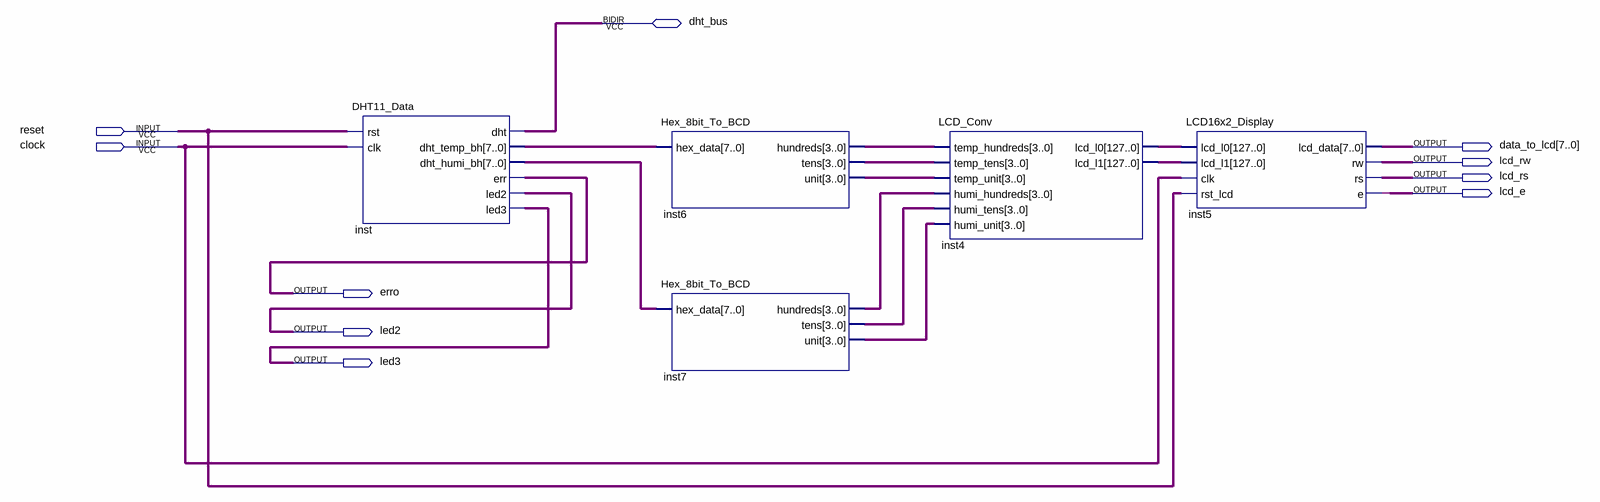
[diagram p0: schematic sheet]
// Quartus schematic Top_Entity.bdf as structural Verilog: 5 symbols, 10 pins
module Top_Entity (
  input  reset,
  input  clock,
  inout  dht_bus,
  output [7:0] data_to_lcd,
  output lcd_rw,
  output lcd_rs,
  output lcd_e,
  output erro,
  output led2,
  output led3
);

  wire [3:0] inst6_hundreds, inst6_tens, inst6_unit, inst7_hundreds, inst7_tens, inst7_unit;
  wire [7:0] inst_dht_humi_bh, inst_dht_temp_bh;
  wire [127:0] inst4_lcd_l0, inst4_lcd_l1;

  DHT11_Data inst (
    .rst(reset), .clk(clock), .dht_temp_bh(inst_dht_temp_bh), .dht_humi_bh(inst_dht_humi_bh), .err(erro),
    .led2(led2), .led3(led3), .dht(dht_bus));
  Hex_8bit_To_BCD inst6 (.hex_data(inst_dht_temp_bh), .hundreds(inst6_hundreds), .tens(inst6_tens), .unit(inst6_unit));
  Hex_8bit_To_BCD inst7 (.hex_data(inst_dht_humi_bh), .hundreds(inst7_hundreds), .tens(inst7_tens), .unit(inst7_unit));
  LCD_Conv inst4 (
    .temp_hundreds(inst6_hundreds), .temp_tens(inst6_tens), .temp_unit(inst6_unit),
    .humi_hundreds(inst7_hundreds), .humi_tens(inst7_tens), .humi_unit(inst7_unit), .lcd_l0(inst4_lcd_l0),
    .lcd_l1(inst4_lcd_l1));
  LCD16x2_Display inst5 (
    .lcd_l0(inst4_lcd_l0), .lcd_l1(inst4_lcd_l1), .clk(clock), .rst_lcd(reset), .lcd_data(data_to_lcd),
    .rw(lcd_rw), .rs(lcd_rs), .e(lcd_e));
endmodule
